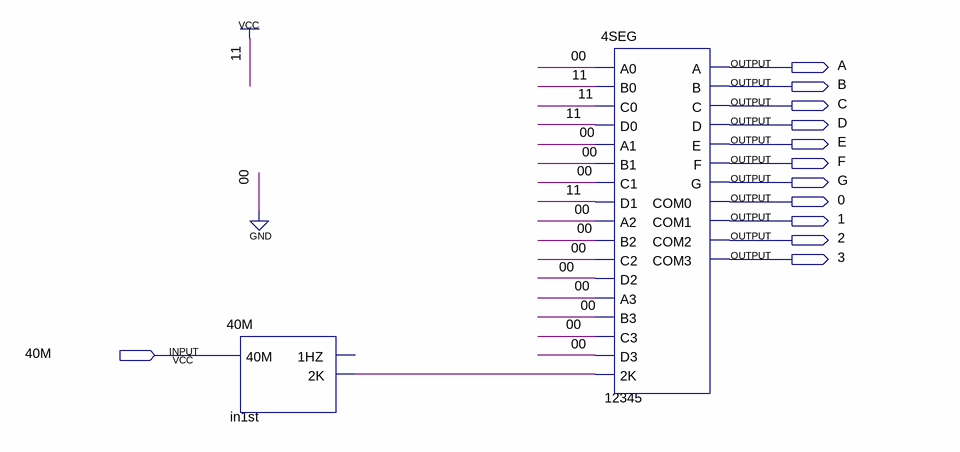
[diagram p0: schematic sheet]
// Quartus schematic 5.bdf as structural Verilog: 2 symbols, 12 pins
module \5  (
  input  \40M ,
  output A,
  output B,
  output C,
  output D,
  output E,
  output F,
  output G,
  output \0 ,
  output \1 ,
  output \2 ,
  output \3 
);

  wire in1st_2k;

  \40M  in1st (.\40M (\40M ), .\2K (in1st_2k));  // open: 1HZ
  \4SEG  u_12345 (
    .A0(1'b0), .B0(1'b1), .C0(1'b1), .D0(1'b1), .A1(1'b0), .B1(1'b0), .C1(1'b0), .D1(1'b1), .A2(1'b0),
    .B2(1'b0), .C2(1'b0), .D2(1'b0), .A3(1'b0), .B3(1'b0), .C3(1'b0), .D3(1'b0), .\2K (in1st_2k), .A(A),
    .B(B), .C(C), .D(D), .E(E), .F(F), .G(G), .COM0(\0 ), .COM1(\1 ), .COM2(\2 ), .COM3(\3 ));
endmodule
